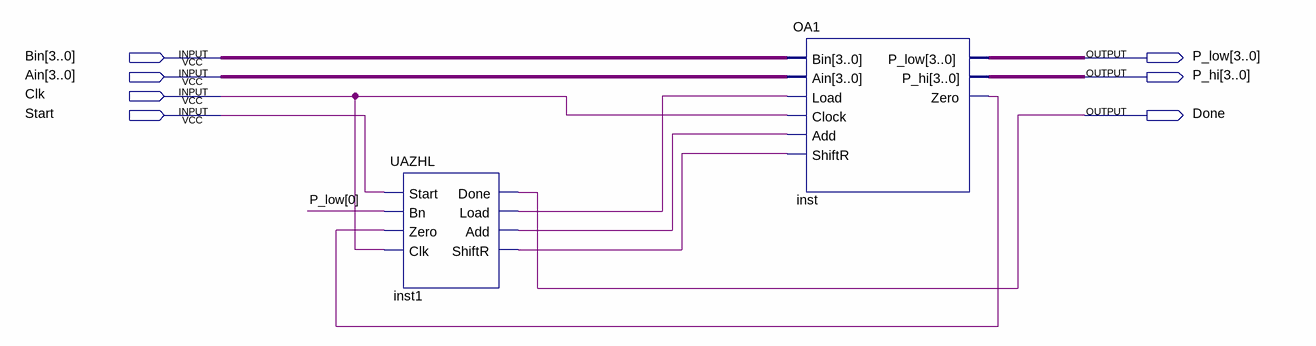
[diagram p0: schematic sheet]
// Quartus schematic CA.bdf as structural Verilog: 2 symbols, 7 pins
module CA (
  input  [3:0] Bin,
  input  [3:0] Ain,
  input  Clk,
  input  Start,
  output [3:0] P_low,
  output [3:0] P_hi,
  output Done
);

  wire inst1_add, inst1_load, inst1_shiftr, inst_zero;

  UAZHL inst1 (
    .Start(Start), .Bn(P_low[0]), .Zero(inst_zero), .Clk(Clk), .Done(Done), .Load(inst1_load),
    .Add(inst1_add), .ShiftR(inst1_shiftr));
  OA1 inst (
    .Bin(Bin), .Ain(Ain), .Load(inst1_load), .Clock(Clk), .Add(inst1_add), .ShiftR(inst1_shiftr),
    .P_low(P_low), .P_hi(P_hi), .Zero(inst_zero));
endmodule
